# Altium project esp32_dht11.PrjPcb
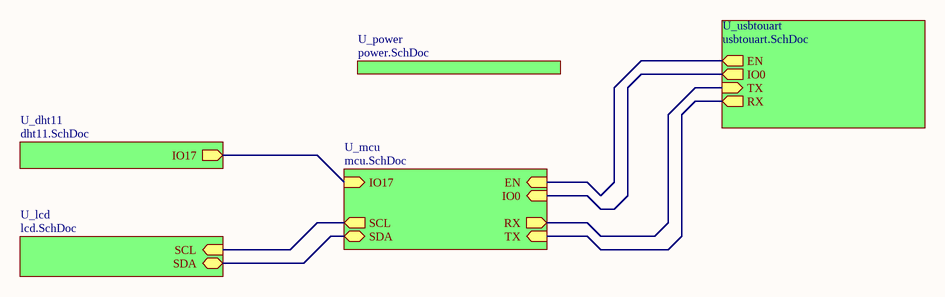
[diagram p0: [00]-esp32_dht11.SchDoc]
6 sheets, 50 parts. Net scope: hierarchical (ports join the sheet entries above them; power ports are global).
Board file: esp32_dht11.PcbDoc
Sheets:
  [00]-esp32_dht11.SchDoc
    U_dht11 = dht11.SchDoc
    U_lcd = lcd.SchDoc
    U_mcu = mcu.SchDoc
    U_usbtouart = usbtouart.SchDoc
    U_power = power.SchDoc

## Sheet [00]-esp32_dht11.SchDoc
size A4; SheetNumber: 1; SheetTotal: 6

### Sub-sheets
U_dht11 = dht11.SchDoc: IO17 (out)
U_lcd = lcd.SchDoc: SCL (in), SDA (bidir)
U_mcu = mcu.SchDoc: EN (in), IO0 (in), IO17 (in), SCL (out), SDA (bidir), TX (in), RX (out)
U_power = power.SchDoc: no entries
U_usbtouart = usbtouart.SchDoc: EN (out), IO0 (out), RX (out), TX (in)

### Nets
EN: sheet U_mcu/EN, sheet U_usbtouart/EN
IO0: sheet U_mcu/IO0, sheet U_usbtouart/IO0
NetC2_2: sheet U_dht11/IO17, sheet U_mcu/IO17
NetLED3_2: sheet U_mcu/TX, sheet U_usbtouart/RX
NetLED4_2: sheet U_mcu/RX, sheet U_usbtouart/TX
NetR5_1: sheet U_lcd/SCL, sheet U_mcu/SCL
NetR6_1: sheet U_lcd/SDA, sheet U_mcu/SDA

## Sheet dht11.SchDoc
size A4; SheetNumber: 2; SheetTotal: 6
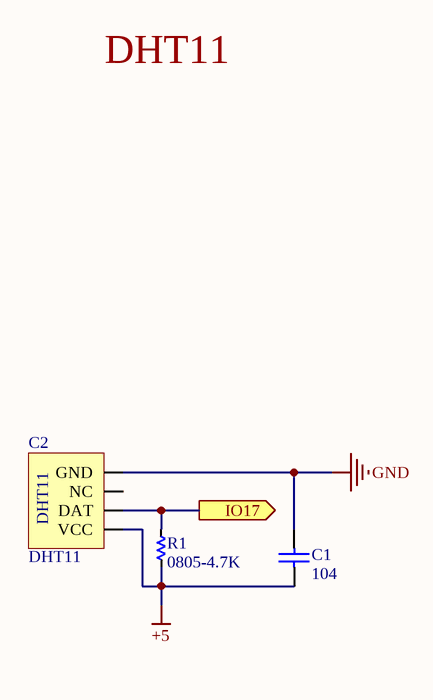
[diagram p1: dht11.SchDoc]

### Parts
(Parts that share a designator on the sheet are numbered #1, #2 ... from top to bottom, then left to right.)
C1#1  104  [0805]
C2  DHT11  [DHT11]
R1  0805-4.7K  [RES-SMD-0805]

### Ports
IO17 (out)

### Nets
+5: C1#1.1 C2.1(VCC) R1.2
GND: C1#1.2 C2.4(GND)
NetC2_2: C2.2(DAT) R1.1 ; port IO17

Not connected (* = marked no-connect by the designer): C2 3(NC)

### Notes on the sheet
- DHT11

### Library data of the parts
C1#1 = Cap 104_SMD: Capacitor (Semiconductor SIM Model); Value: 0.1uF; Published: 8-Jun-2000; LatestRevisionDate: 17-Jul-2002; LatestRevisionNote: Re-released for DXP Platform.; PackageReference: C1206; Publisher: Altium Limited
C2 = DHT11: Manufacturer: W¨¹rth Elektronik eiSos GmbH; partNo: 613004143121; ComponentLink1 Description: Manufacturer; ComponentLink2 Description: Datasheet; NoPins: 04; Created Date: 29 March 2013; ComponentLink1URL: http://www.we-online.com; ComponentLink2URL: http://katalog.we-online.de/em/datasheet/6130xx143121.pdf; Created by: Karrer Zheng
R1 = Res-SMD: Resistor; Manufacturer: Generic Components; Class: Passive; Published: 08/06/2000; Publisher: Altium Hobart Technology Centre

## Sheet lcd.SchDoc
size A4; SheetNumber: 4; SheetTotal: 6
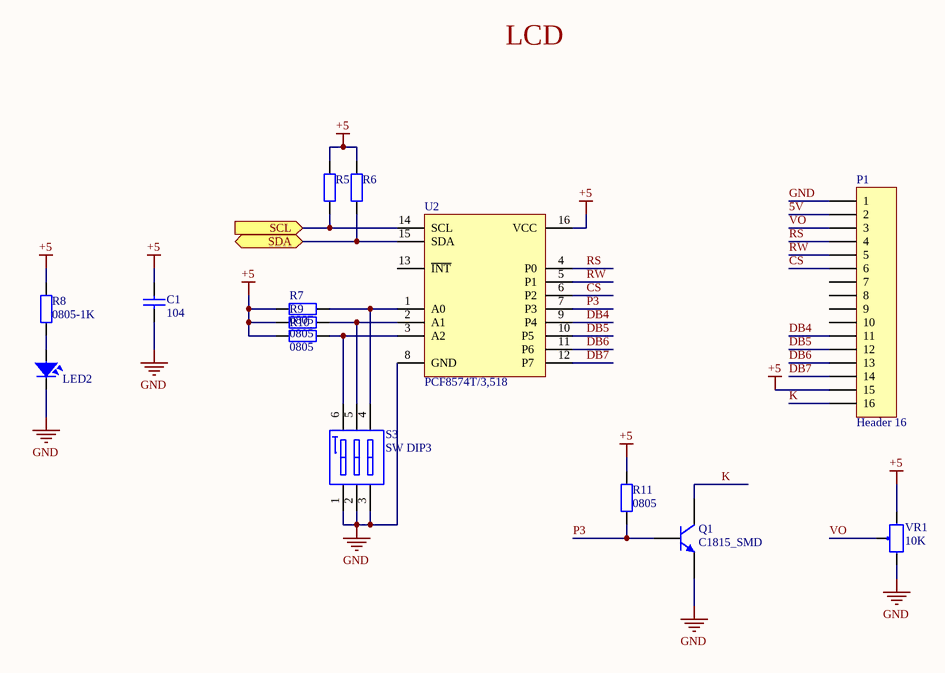
[diagram p2: lcd.SchDoc]

### Parts
(Parts that share a designator on the sheet are numbered #1, #2 ... from top to bottom, then left to right.)
C1#2  104  [0805]
LED2  LED  [LED-0805-Orange]  (value not drawn)
P1  Header 16  [HDR1X16]
Q1  C1815_SMD  [SOT23]
R5  R0805-4k7  [DIEN TRO 0805]  (value not drawn)
R6  R0805-4k7  [DIEN TRO 0805]  (value not drawn)
R7  value 0805  [DIEN TRO 0805]  (hidden comment: R0805-10K)
R8  value 0805-1K  [DIEN TRO 0805]  (hidden comment: R0805)
R9  value 0805  [DIEN TRO 0805]  (hidden comment: R0805-10K)
R10  value 0805  [DIEN TRO 0805]  (hidden comment: R0805-10K)
R11  value 0805  [DIEN TRO 0805]  (hidden comment: R0805)
S3  SW DIP3  [DIPSWITCH3]
U2  PCF8574T/3,518  [SO-16-WIDE]
VR1  10K  [VR]

### Ports
SCL (in), SDA (bidir)

### Nets
+5: C1#2.2 P1.15 R5.2 R6.2 R7.1 R8.2 R9.1 R10.1 R11.2 U2.16(VCC) VR1.3
GND: C1#2.1 LED2.2 P1.1 Q1.2(E) S3.1(A1) S3.2(A2) S3.3(A3) U2.8(GND) VR1.1
5V: P1.2
CS: P1.6 U2.6(P2)
DB4: P1.11 U2.9(P4)
DB5: P1.12 U2.10(P5)
DB6: P1.13 U2.11(P6)
DB7: P1.14 U2.12(P7)
K: P1.16 Q1.3(C)
P3: Q1.1(B) R11.1 U2.7(P3)
RS: P1.4 U2.4(P0)
RW: P1.5 U2.5(P1)
VO: P1.3 VR1.2
NetLED2_1: LED2.1 R8.1
NetR5_1: R5.1 U2.14(SCL) ; port SCL
NetR6_1: R6.1 U2.15(SDA) ; port SDA
NetR7_2: R7.2 S3.4(B3) U2.1(A0)
NetR9_2: R9.2 S3.5(B2) U2.2(A1)
NetR10_2: R10.2 S3.6(B1) U2.3(A2)

Not connected (* = marked no-connect by the designer): P1 7 8 9 10; U2 13(~{INT})

### Notes on the sheet
- LCD

### Library data of the parts
C1#2 = Cap 104_SMD: as C1#1 on sheet dht11; Published: 8-Jun-2000; LatestRevisionDate: 17-Jul-2002; LatestRevisionNote: Re-released for DXP Platform.; PackageReference: C1206; Publisher: Altium Limited
LED2 = LED SMD: Value: LED 3 - 5 ly 2 Colour
P1 = Header 16: Header, 16-Pin; LatestRevisionDate: 17-Jul-2002; LatestRevisionNote: Re-released for DXP Platform.; Publisher: Altium Limited
Q1 = C1815_SMD: NPN General Purpose Amplifier; Published: 8-Jun-2000; LatestRevisionDate: 15-Jan-2003; LatestRevisionNote: PCB Footprint 'BCY-W3/D4.7' replaced; DatasheetVersion: 1997; PackageVersion: Sep-1998; PackageReference: TO-92A; Publisher: Altium Limited; Code_JEDEC: TO-92A; ComponentLink1Description: Manufacturer Link; ComponentLink1URL: http://www.fairchildsemi.com/; ComponentLink2Description: Datasheet; ComponentLink2URL: http://www.fairchildsemi.com/ds/2N%2F2N3904.pdf
R5 R6 R11 = R0805: Resistor SMD 0805; Published: 8-Jun-2000; LatestRevisionDate: 17-Jul-2002; LatestRevisionNote: Re-released for DXP Platform.; PackageReference: AXIAL-0.4; Publisher: Altium Limited
  R5 R6: Value: 0805-4k7
R7 R9 R10 = R0805: Resistor SMD 0805-10K; Published: 8-Jun-2000; LatestRevisionDate: 17-Jul-2002; LatestRevisionNote: Re-released for DXP Platform.; PackageReference: AXIAL-0.4; Publisher: Altium Limited
R8 = R0805: Resistor SMD 0805-1K; Published: 8-Jun-2000; LatestRevisionDate: 17-Jul-2002; LatestRevisionNote: Re-released for DXP Platform.; PackageReference: AXIAL-0.4; Publisher: Altium Limited
S3 = SW DIP3: DIP Switch, 3 Position, SPST; Published: 24-Mar-1999; LatestRevisionDate: 17-Jul-2002; LatestRevisionNote: Re-released for DXP Platform.; PackageReference: DIP-6; Publisher: Altium Limited; Code_JEDEC: MO-001-AM
U2 = PCF8574T/3,518: IC I/O EXPANDER I2C 8B 16SOIC; Manufacturer: NXP USA Inc.; Number of I/O: 8; Interface: I²C; Interrupt Output: Yes; Output Type: Push-Pull; Current - Output Source/Sink: 300µA, 25mA; Voltage - Supply: 2.5 V ~ 6 V; Supplier 1: Digi-Key; Manufacturer Part Number: PCF8574T/3,518; RoHS: RoHS Compliant; Category: Integrated Circuits (ICs); Stock 1: 21482; Pricing 1: 1=1.22, 10=1.094, 100=0.8528, 500=0.70452 (USD); Packaging: Cut Tape (CT); Part Status: Active; Features: POR; Operating Temperature: -40°C ~ 85°C; Mounting Type: Surface Mount; Package / Case: 16-SOIC (0.295", 7.50mm Width); Supplier Device Package: 16-SO; ComponentLink1URL: http://www.nxp.com/documents/data_sheet/PCF8574_PCF8574A.pdf; ComponentLink1Description: http://www.nxp.com/documents/data_sheet/PCF8574_PCF8574A.pdf; Supplier Part Number 1: 568-1077-1-ND
VR1 = VR_1: Var Resistor; Value: VR 10K

## Sheet mcu.SchDoc
size A4; SheetNumber: 3; SheetTotal: 6
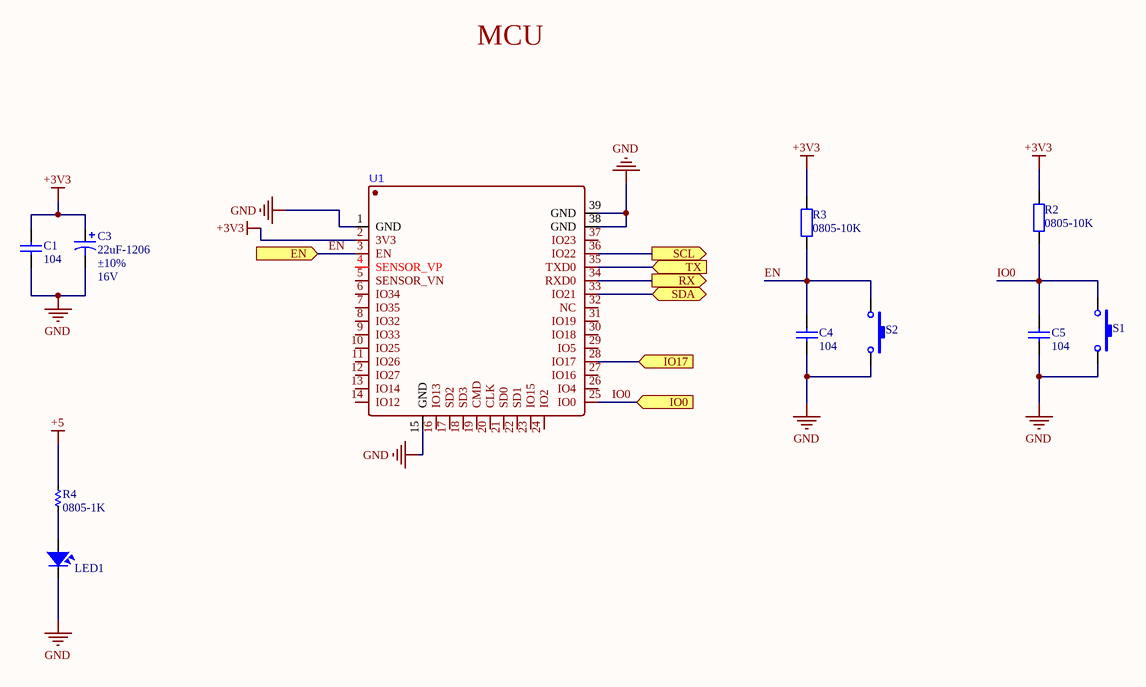
[diagram p3: mcu.SchDoc]

### Parts
(Parts that share a designator on the sheet are numbered #1, #2 ... from top to bottom, then left to right.)
C1#3  104  [0805]
C3  22uF-1206  Tolerance: ±10%  Voltage - Rated: 16V  [CAP1206_TANTALUM_YELLOW]
C4  104  [0805]
C5  104  [0805]
LED1  LED  [LED-0805-Orange]  (value not drawn)
R2  value 0805-10K  [DIEN TRO 0805]  (hidden comment: R0805)
R3  value 0805-10K  [DIEN TRO 0805]  (hidden comment: R0805)
R4  0805-1K  [RES-SMD-0805]
S1  MH001036  [SW-SMD]  (value not drawn)
S2  MH001036  [SW-SMD]  (value not drawn)
U1  ESP32-WROOM-32D-N8  [ESP32-SMD]  (value not drawn)

### Ports
EN (in), IO0 (in), IO17 (in), RX (out), SCL (out), SDA (bidir), TX (in)

### Nets
+3V3: C1#3.2 C3.1 R2.2 R3.2 U1.2(3V3)
+5: R4.1
GND: C1#3.1 C3.2 C4.1 C5.1 LED1.2 S1.2 S2.2 U1.1(GND) U1.15(GND) U1.38(GND) U1.39(GND)
EN: C4.2 R3.1 S2.1 U1.3(EN) ; port EN
IO0: C5.2 R2.1 S1.1 U1.25(IO0) ; port IO0
NetC2_2: U1.28(IO17) ; port IO17
NetLED1_1: LED1.1 R4.2
NetLED3_2: U1.35(TXD0) ; port TX
NetLED4_2: U1.34(RXD0) ; port RX
NetR5_1: U1.36(IO22) ; port SCL
NetR6_1: U1.33(IO21) ; port SDA

Not connected (* = marked no-connect by the designer): U1 4(SENSOR_VP) 5(SENSOR_VN) 6(IO34) 7(IO35) 8(IO32) 9(IO33) 10(IO25) 11(IO26) 12(IO27) 13(IO14) 14(IO12) 16(IO13) 17(SD2) 18(SD3) 19(CMD) 20(CLK) 21(SD0) 22(SD1) 23(IO15) 24(IO2) 26(IO4) 27(IO16) 29(IO5) 30(IO18) 31(IO19) 32(NC) 37(IO23)

### Notes on the sheet
- MCU

### Library data of the parts
C1#3 C4 C5 = Cap 104_SMD: as C1#1 on sheet dht11; Published: 8-Jun-2000; LatestRevisionDate: 17-Jul-2002; LatestRevisionNote: Re-released for DXP Platform.; PackageReference: C1206; Publisher: Altium Limited
C3 = T491A106K016AT: CAP TANT 10UF 16V 10% 1206; Manufacturer 1: KEMET; Manufacturer Size Code: A; Category 1: Capacitors; Capacitance: 10µF; Type: Molded; ESR (Equivalent Series Resistance): 7 Ohm; Lifetime @ Temp.: 2000 Hrs @ 85°C; Supplier 1: Digi-Key; Supplier Part Number 1: 399-8269-1-ND; Manufacturer Part Number 1: T491A106K016AT; RoHS 1: RoHS Compliant; Description 1: CAP TANT 10UF 16V 10% 1206; Stock 1: 54083; Pricing 1: 1=0.45, 10=0.312, 100=0.1873, 500=0.14048, 1000=0.11862 (USD); Packaging: Cut Tape (CT); Part Status: Active; Operating Temperature: -55°C ~ 125°C; Mounting Type: Surface Mount; Package / Case: 1206 (3216 Metric); Size / Dimension: 0.126" L x 0.063" W (3.20mm x 1.60mm); Height - Seated (Max): 0.071" (1.80mm); Lead Spacing: -; Features: General Purpose; Failure Rate: -; ComponentLink1URL: http://www.kemet.com/Lists/ProductCatalog/Attachments/254/KEM_T2005_T491.pdf; ComponentLink1Description: http://www.kemet.com/Lists/ProductCatalog/Attachments/254/KEM_T2005_T491.pdf; Value: 10uF
LED1 = LED SMD: Value: LED 3 - 5 ly 2 Colour
R2 R3 = R0805: Resistor SMD 0805; Published: 8-Jun-2000; LatestRevisionDate: 17-Jul-2002; LatestRevisionNote: Re-released for DXP Platform.; PackageReference: AXIAL-0.4; Publisher: Altium Limited
R4 = Res-SMD: as R1 on sheet dht11; Published: 08/06/2000; Publisher: Altium Hobart Technology Centre
S1 S2 = SW-SMD: Dán; Value: Nút Nhấn 2 Chân 3x6x2.5MM SMD

## Sheet usbtouart.SchDoc
size A4; SheetNumber: 6; SheetTotal: 6
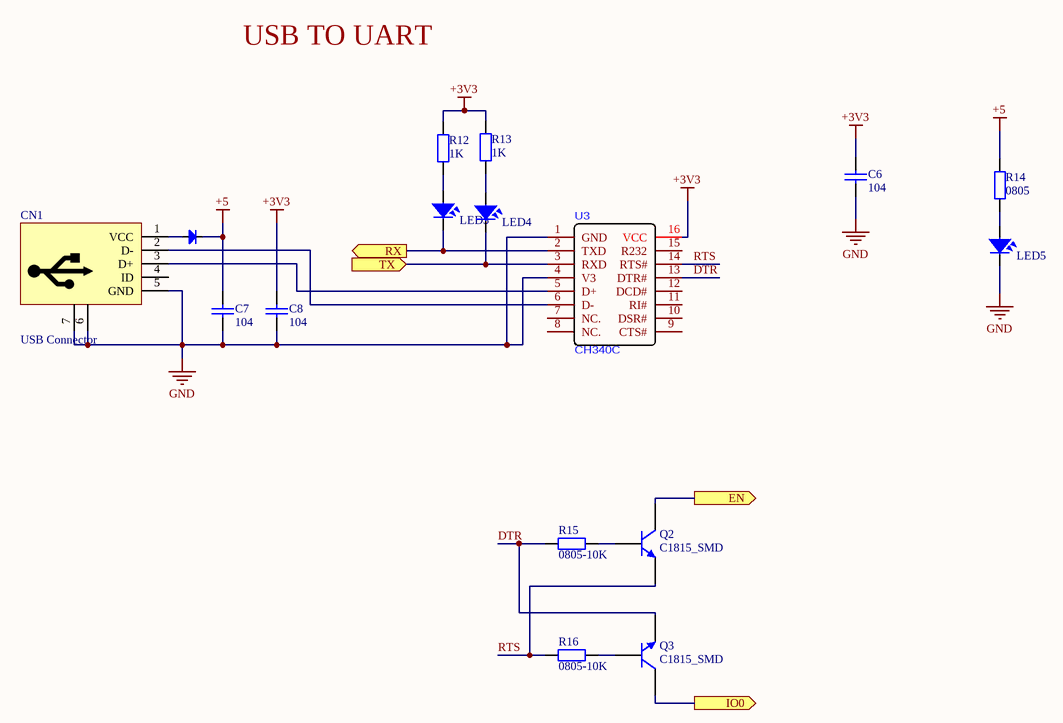
[diagram p4: usbtouart.SchDoc]

### Parts
C6  104  [0805]
C7  104  [0805]
C8  104  [0805]
CN1  USB Connector  [USB-B-Micro-Hole]
DIO1  Diode SMD  [DIO-SMD-106]  (value not drawn)
LED3  LED  [LED-0805-Red]  (value not drawn)
LED4  LED  [LED-0805-Red]  (value not drawn)
LED5  LED  [LED-0805-Orange]  (value not drawn)
Q2  C1815_SMD  [SOT23]
Q3  C1815_SMD  [SOT23]
R12  value 1K  [DIEN TRO 0805]  (hidden comment: R0805)
R13  value 1K  [DIEN TRO 0805]  (hidden comment: R0805)
R14  value 0805  [DIEN TRO 0805]  (hidden comment: R0805)
R15  value 0805-10K  [DIEN TRO 0805]  (hidden comment: R0805)
R16  value 0805-10K  [DIEN TRO 0805]  (hidden comment: R0805)
U3  CH340C  [SOP-16_L10.0-W3.9-P1.27-LS6.0-BL]

### Ports
EN (out), IO0 (out), RX (out), TX (in)

### Nets
+3V3: C6.2 C8.2 R12.2 R13.2 U3.16(VCC)
+5: C7.2 DIO1.2(K) R14.2
GND: C6.1 C7.1 C8.1 CN1.5(GND) CN1.6(SHIELD) CN1.7(SHIELD) LED5.2 U3.1(GND) U3.4(V3)
DTR: Q3.2(E) R15.1 U3.13(DTR#)
EN: Q2.3(C) ; port EN
IO0: Q3.3(C) ; port IO0
RTS: Q2.2(E) R16.1 U3.14(RTS#)
NetCN1_1: CN1.1(VCC) DIO1.1(A)
NetCN1_2: CN1.2(D-) U3.6(D-)
NetCN1_3: CN1.3(D+) U3.5(D+)
NetLED3_1: LED3.1 R12.1
NetLED3_2: LED3.2 U3.2(TXD) ; port RX
NetLED4_1: LED4.1 R13.1
NetLED4_2: LED4.2 U3.3(RXD) ; port TX
NetLED5_1: LED5.1 R14.1
NetQ2_1: Q2.1(B) R15.2
NetQ3_1: Q3.1(B) R16.2

Not connected (* = marked no-connect by the designer): CN1 4(ID); U3 7(NC.) 8(NC.) 9(CTS#) 10(DSR#) 11(RI#) 12(DCD#) 15(R232)

### Notes on the sheet
- USB TO UART

### Library data of the parts
C6-C8 = Cap 104_SMD: as C1#1 on sheet dht11; Published: 8-Jun-2000; LatestRevisionDate: 17-Jul-2002; LatestRevisionNote: Re-released for DXP Platform.; PackageReference: C1206; Publisher: Altium Limited
CN1 = USB_MICRO_TYPE_B
DIO1 = Diode SMD: Default Diode; Code - JEDEC: DO-214-AB; Value: 1N5007; Published: 8-Jun-2000; Revision: July-2002: Re-released for DXP Platform.; Publisher: Altium Limited
LED3-LED5 = LED SMD: Value: LED 3 - 5 ly 2 Colour
Q2 Q3 = C1815_SMD: NPN General Purpose Amplifier; Published: 8-Jun-2000; LatestRevisionDate: 15-Jan-2003; LatestRevisionNote: PCB Footprint 'BCY-W3/D4.7' replaced; DatasheetVersion: 1997; PackageVersion: Sep-1998; PackageReference: TO-92A; Publisher: Altium Limited; Code_JEDEC: TO-92A; ComponentLink1Description: Manufacturer Link; ComponentLink1URL: http://www.fairchildsemi.com/; ComponentLink2Description: Datasheet; ComponentLink2URL: http://www.fairchildsemi.com/ds/2N%2F2N3904.pdf
R12-R16 = R0805: Resistor SMD 0805; Published: 8-Jun-2000; LatestRevisionDate: 17-Jul-2002; LatestRevisionNote: Re-released for DXP Platform.; PackageReference: AXIAL-0.4; Publisher: Altium Limited

## Sheet power.SchDoc
size A4; SheetNumber: 5; SheetTotal: 6
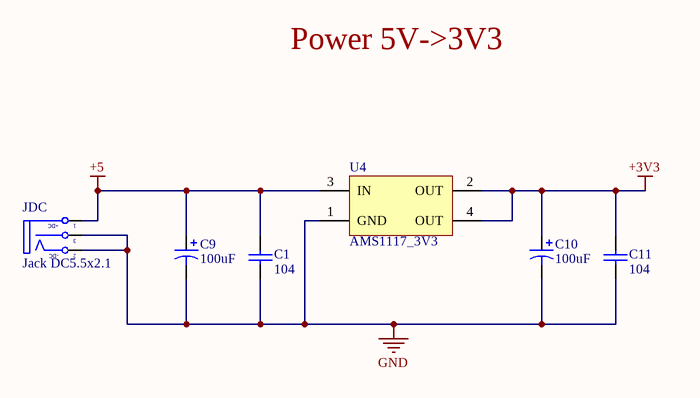
[diagram p5: power.SchDoc]

### Parts
(Parts that share a designator on the sheet are numbered #1, #2 ... from top to bottom, then left to right.)
C1#4  104  [0805]
C9  value 100uF  [CAP_ALUMINUM_SMD_SIZE_D]  (hidden comment: Cap Polar)
C10  value 100uF  [CAP_ALUMINUM_SMD_SIZE_D]  (hidden comment: Cap Polar)
C11  104  [0805]
JDC  Jack DC5.5x2.1  [DC-IN]
U4  AMS1117_3V3  [SOT223-4M]

### Nets
+3V3: C10.1 C11.2 U4.2(OUT) U4.4(OUT)
+5: C1#4.2 C9.1 JDC.1(T) U4.3(IN)
GND: C1#4.1 C9.2 C10.2 C11.1 JDC.2(TN) JDC.3(S) U4.1(GND)

### Notes on the sheet
- Power 5V->3V3
- (in symbol Jac_DC) +DC; -DC

### Library data of the parts
C1#4 C11 = Cap 104_SMD: as C1#1 on sheet dht11; Published: 8-Jun-2000; LatestRevisionDate: 17-Jul-2002; LatestRevisionNote: Re-released for DXP Platform.; PackageReference: C1206; Publisher: Altium Limited
C9 C10 = Cap Polar: Polarized Capacitor; Published: 8-Jun-2000; LatestRevisionDate: 17-Jul-2002; LatestRevisionNote: Re-released for DXP Platform.; PackageReference: POLAR0.8; Publisher: Altium Limited
JDC = Jac_DC: Cắm; Ten_Linh_Kien: Jack DC5.5x2.1MM DC5501; Ma_Hang: MH000923; Don_Vi: Con; Kieu_Chan: *; Ghi_Chu: *; Chung_Loai: Cắm
U4 = AMS1117_3V3: 1A Regulator

## Nets that join several sheets
+3V3: mcu (5 pins), usbtouart (5 pins), power (C10.1 C11.2 U4.2 U4.4)
+5: dht11 (C1#1.1 C2.1 R1.2), lcd (11 pins), mcu (R4.1), usbtouart (C7.2 DIO1.2 R14.2), power (C1#4.2 C9.1 JDC.1 U4.3)
GND: dht11 (C1#1.2 C2.4), lcd (9 pins), mcu (11 pins), usbtouart (9 pins), power (7 pins)
EN: mcu (C4.2 R3.1 S2.1 U1.3), usbtouart (Q2.3)
IO0: mcu (C5.2 R2.1 S1.1 U1.25), usbtouart (Q3.3)
NetC2_2: dht11 (C2.2 R1.1), mcu (U1.28)
NetLED3_2: mcu (U1.35), usbtouart (LED3.2 U3.2)
NetLED4_2: mcu (U1.34), usbtouart (LED4.2 U3.3)
NetR5_1: lcd (R5.1 U2.14), mcu (U1.36)
NetR6_1: lcd (R6.1 U2.15), mcu (U1.33)